# EAGLE schematic PortableLinuxGamestation (EAGLE 9.1.2)
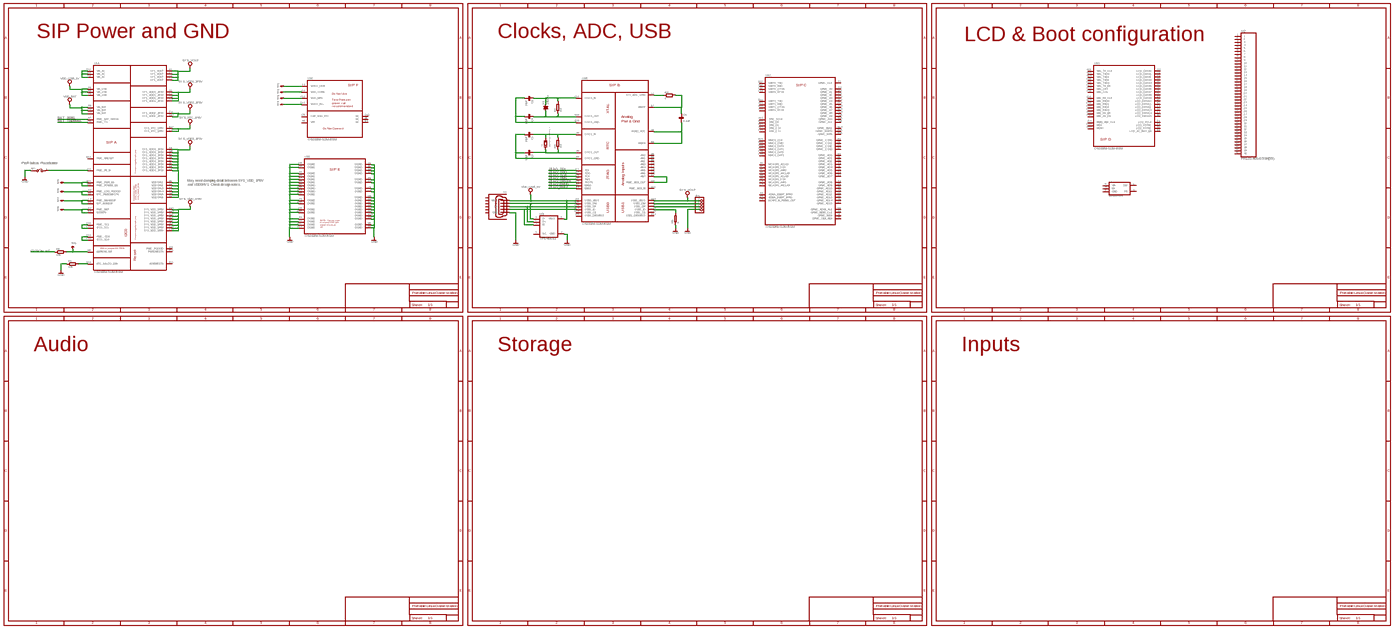
[diagram p0: schematic, sheet 1, overview]
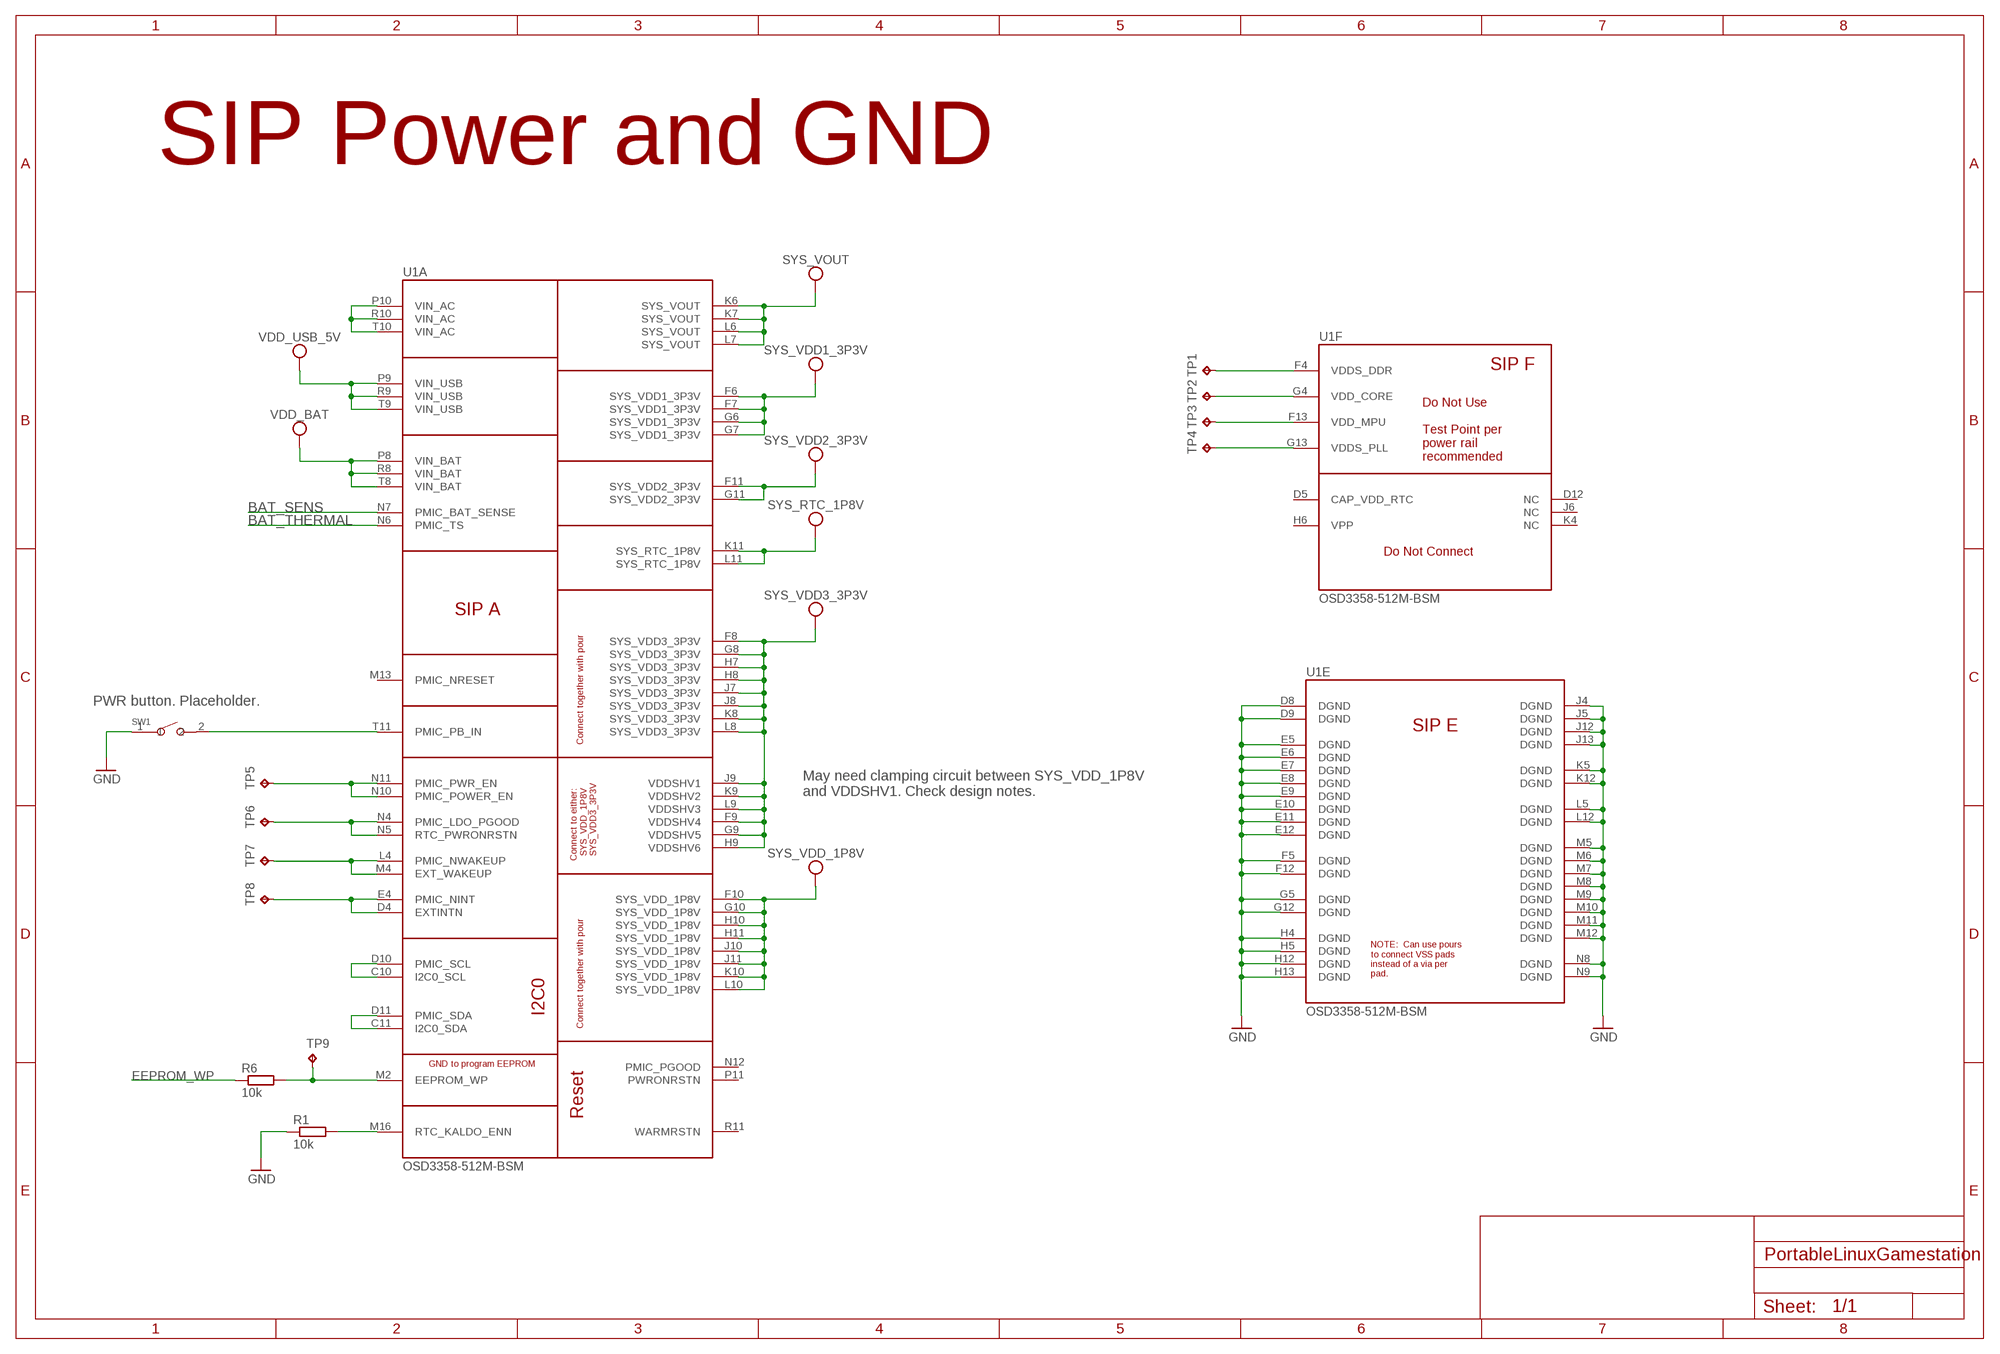
[diagram p1: schematic, sheet 1, part 1 of 8]
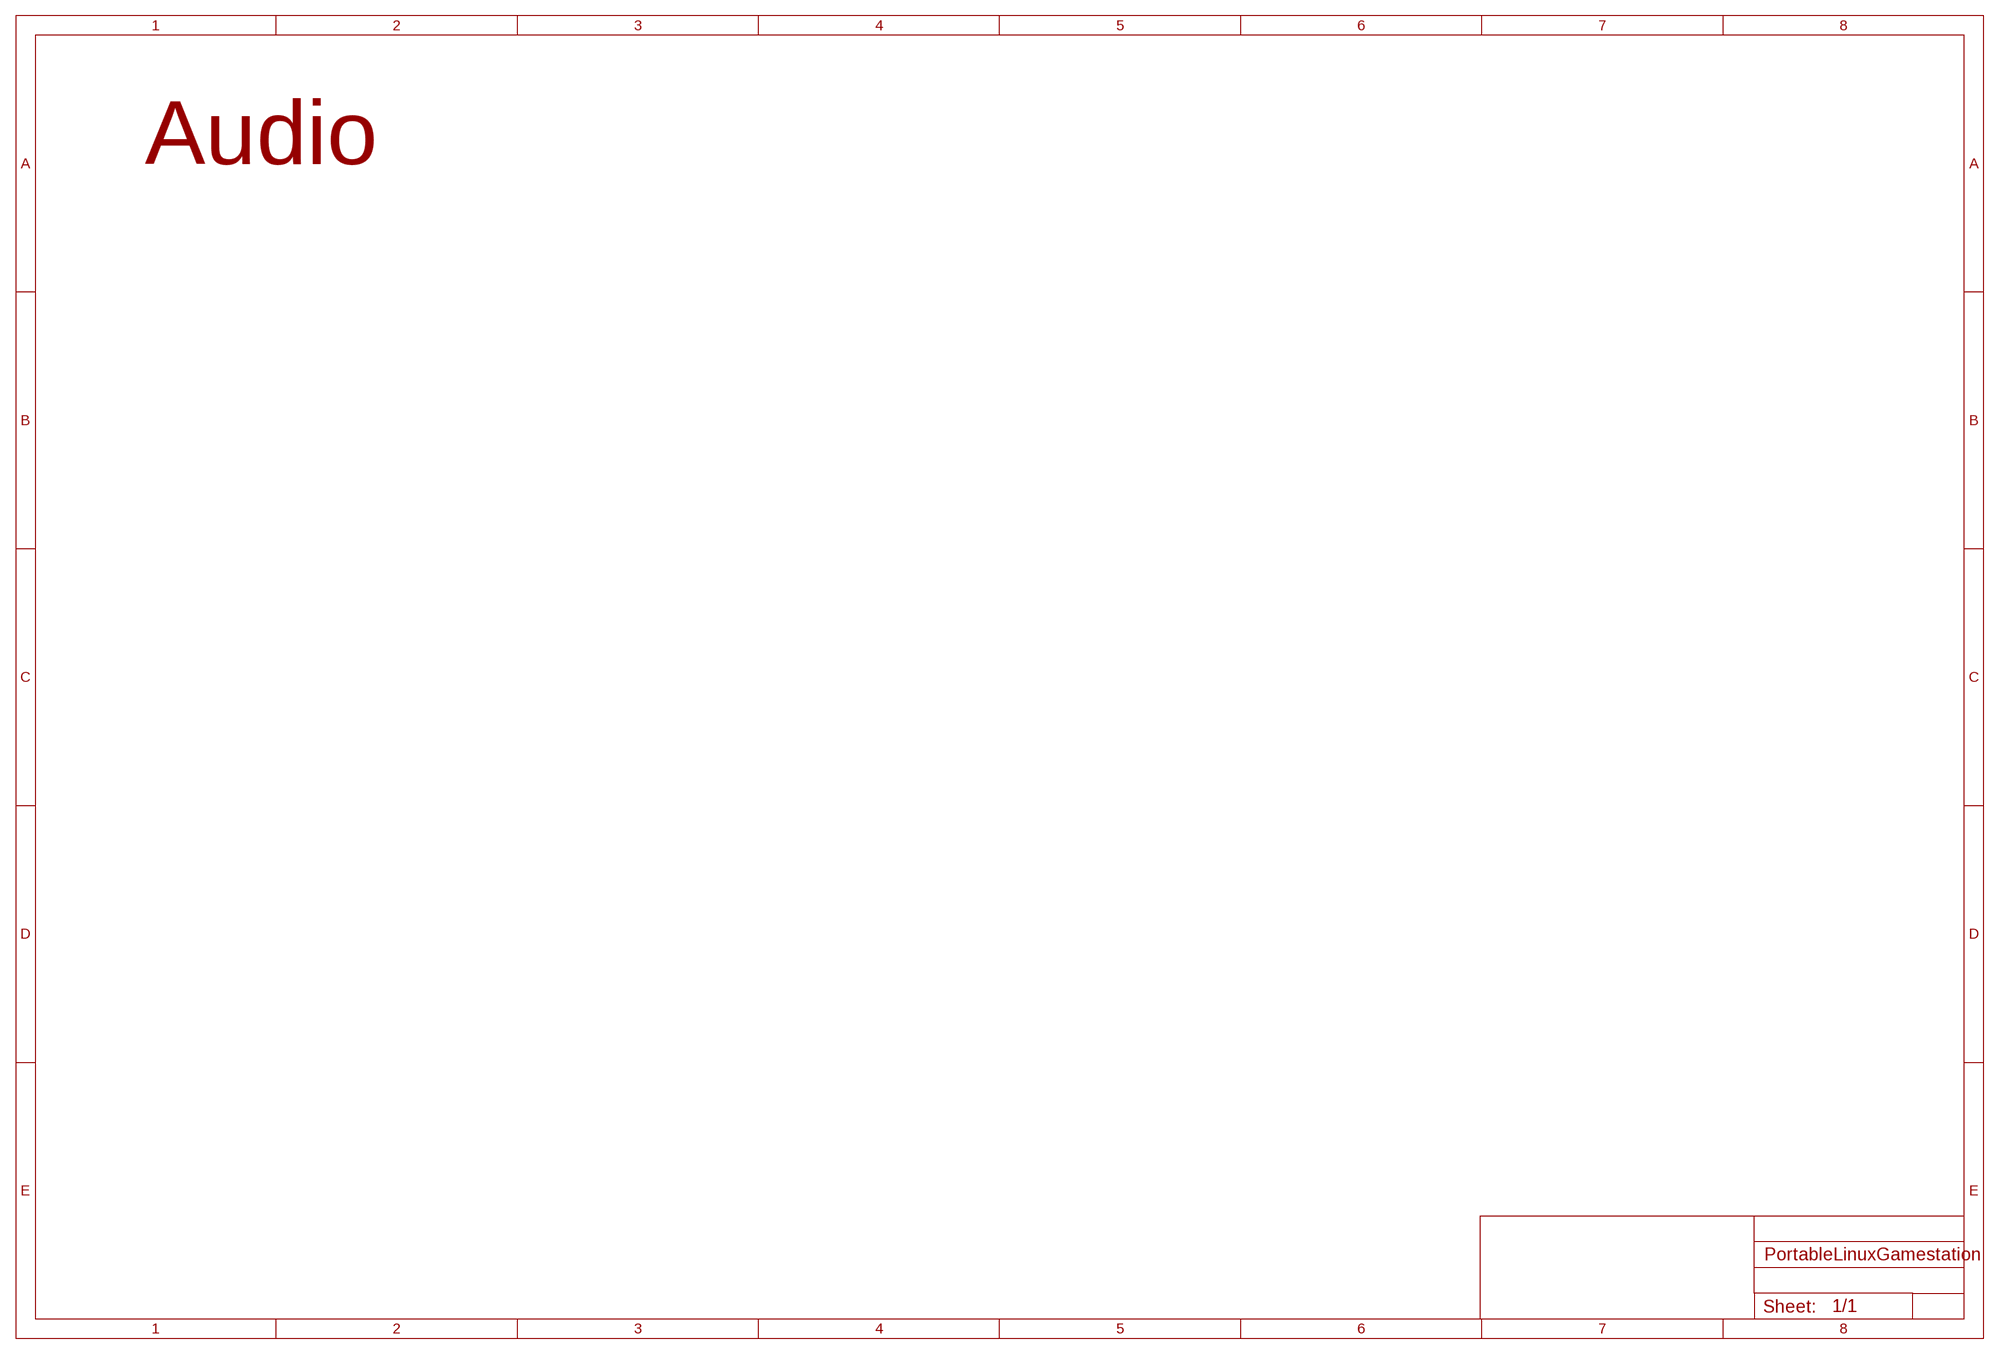
[diagram p2: schematic, sheet 1, part 2 of 8]
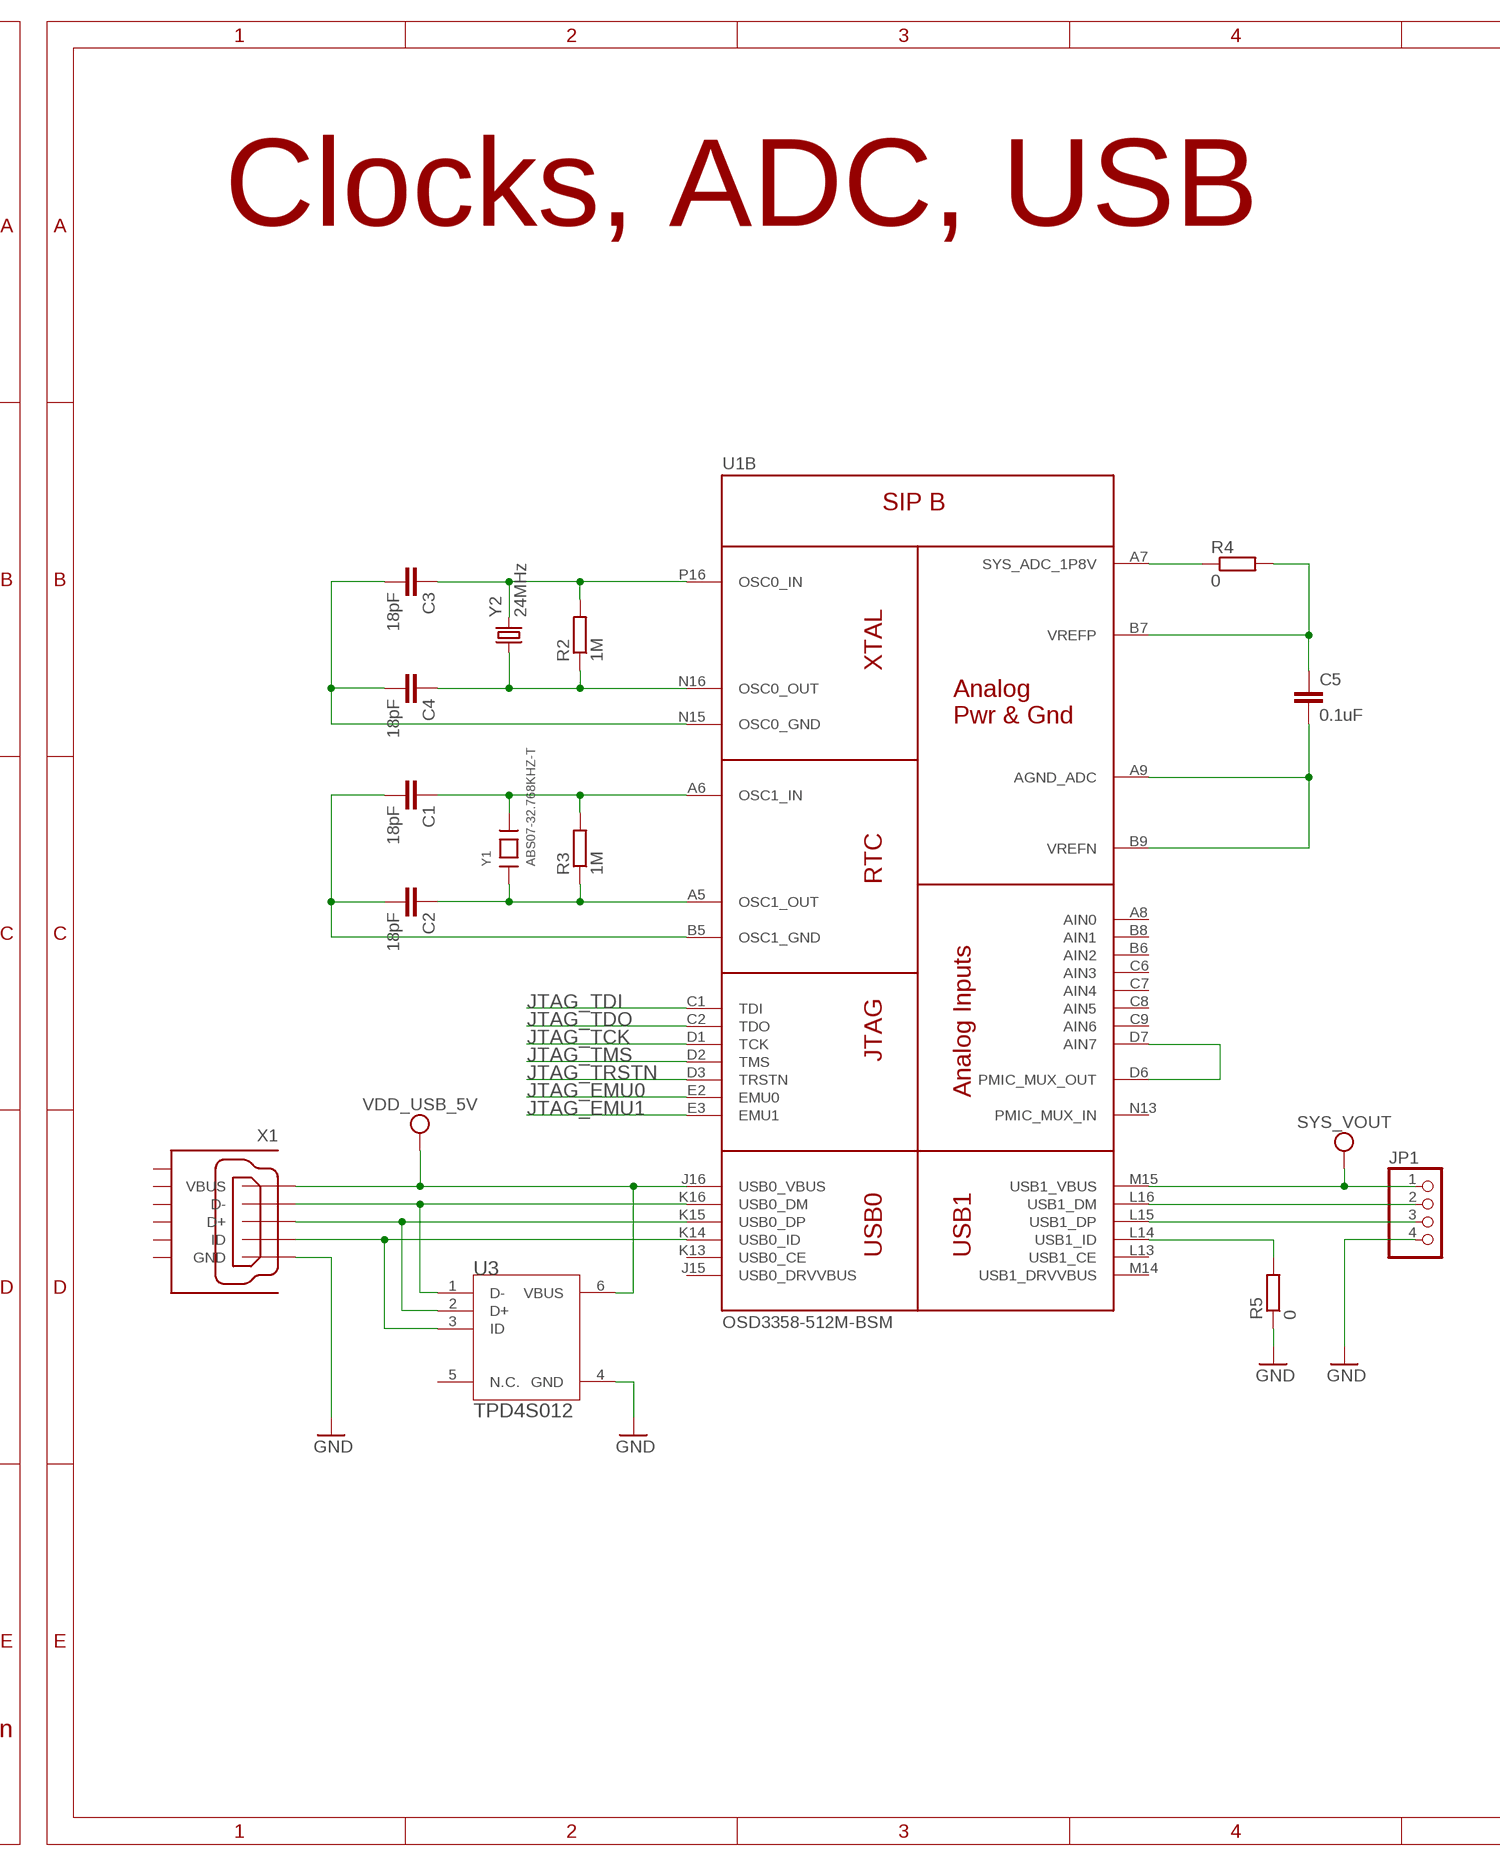
[diagram p3: schematic, sheet 1, part 3 of 8]
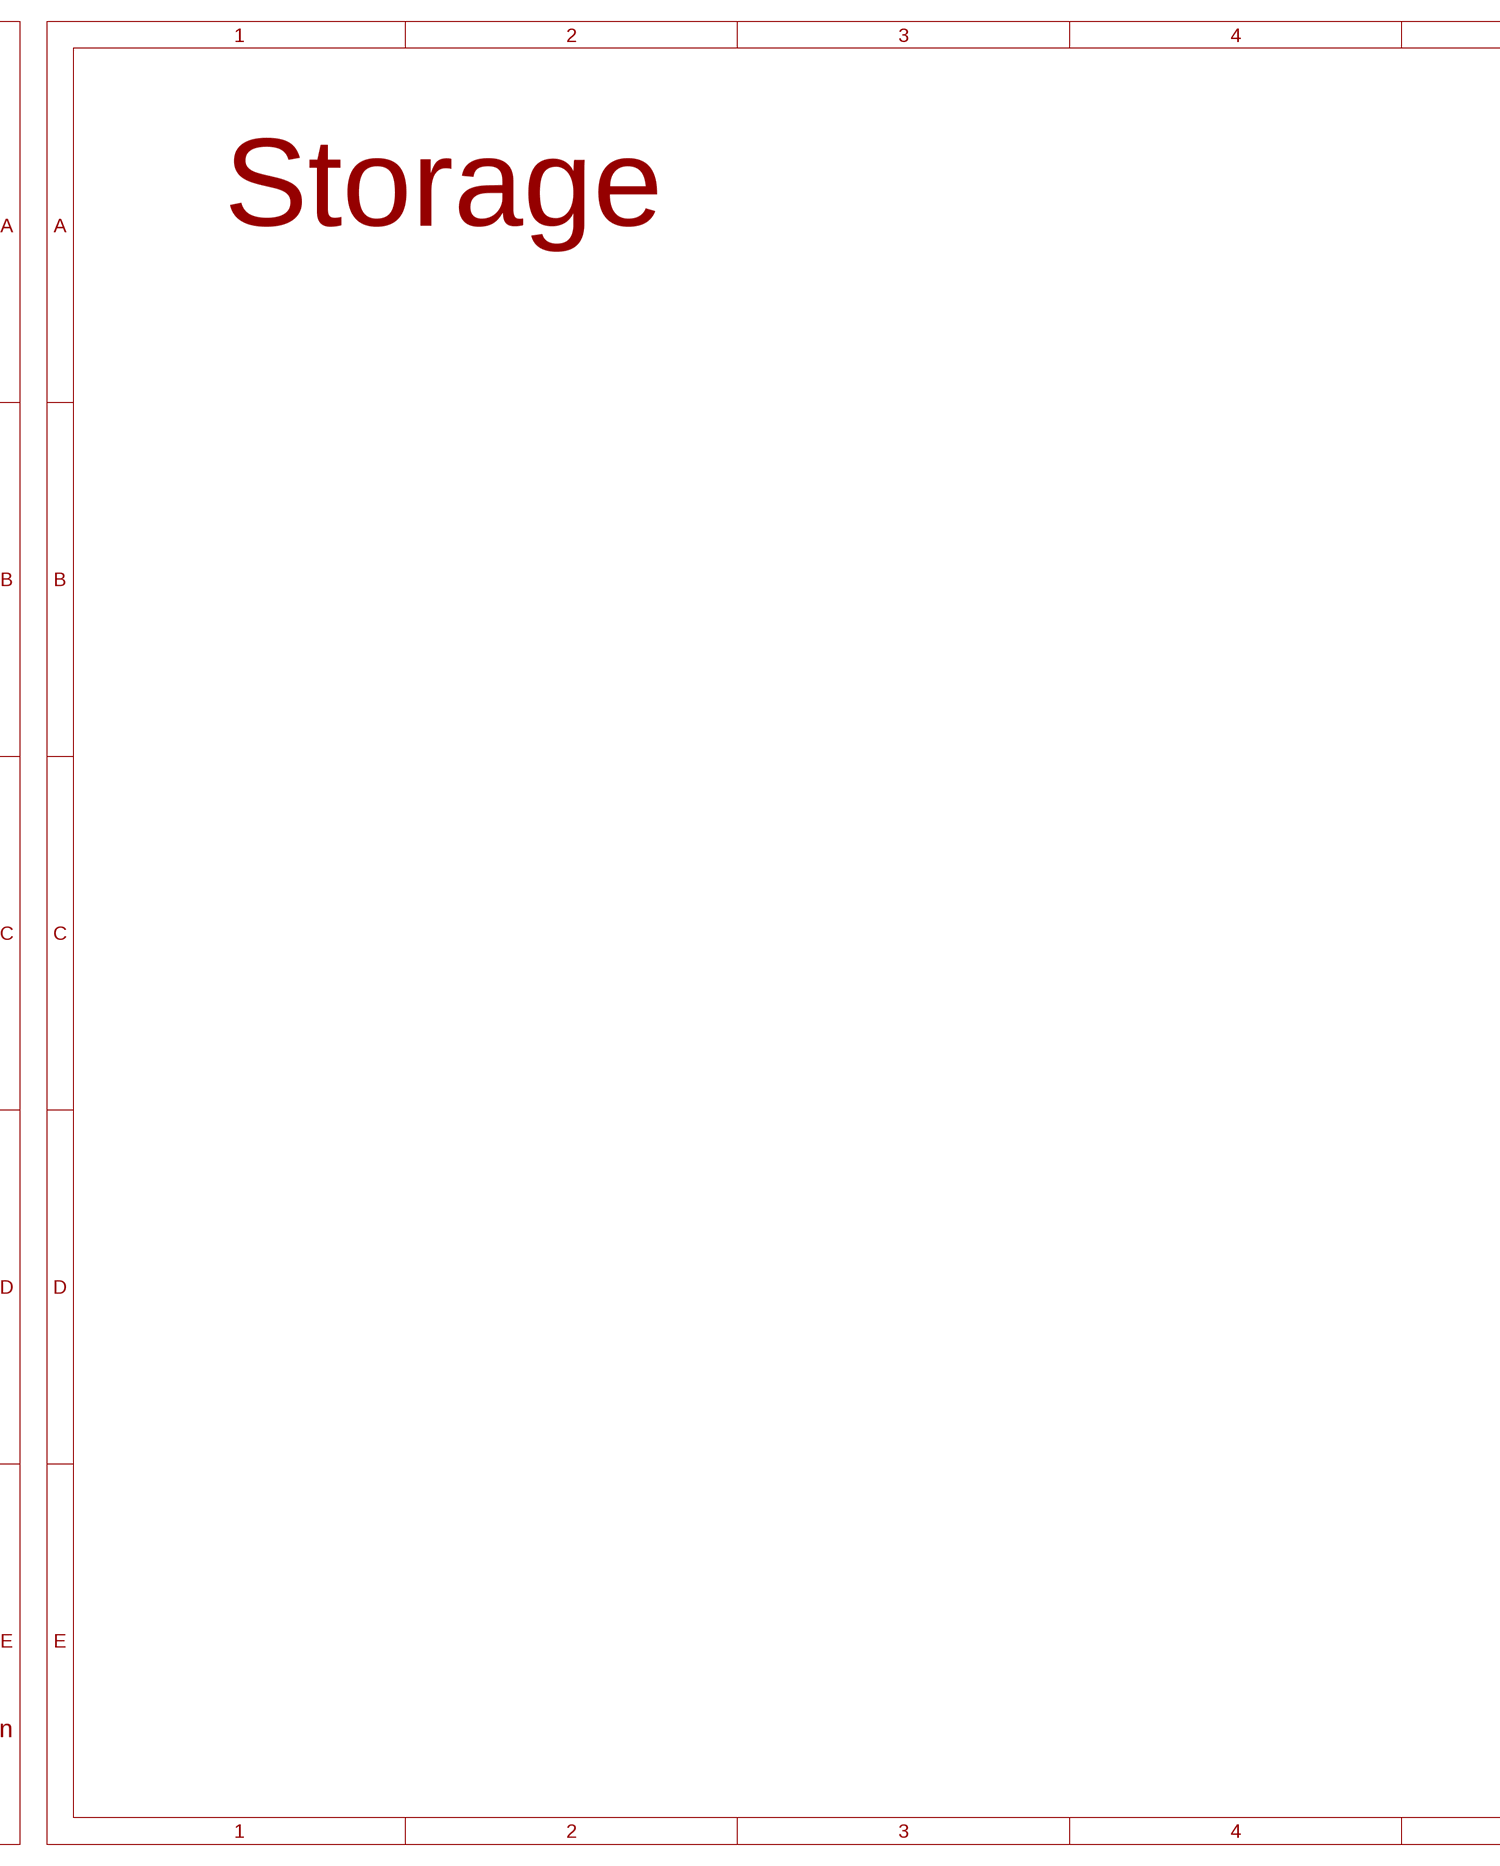
[diagram p4: schematic, sheet 1, part 4 of 8]
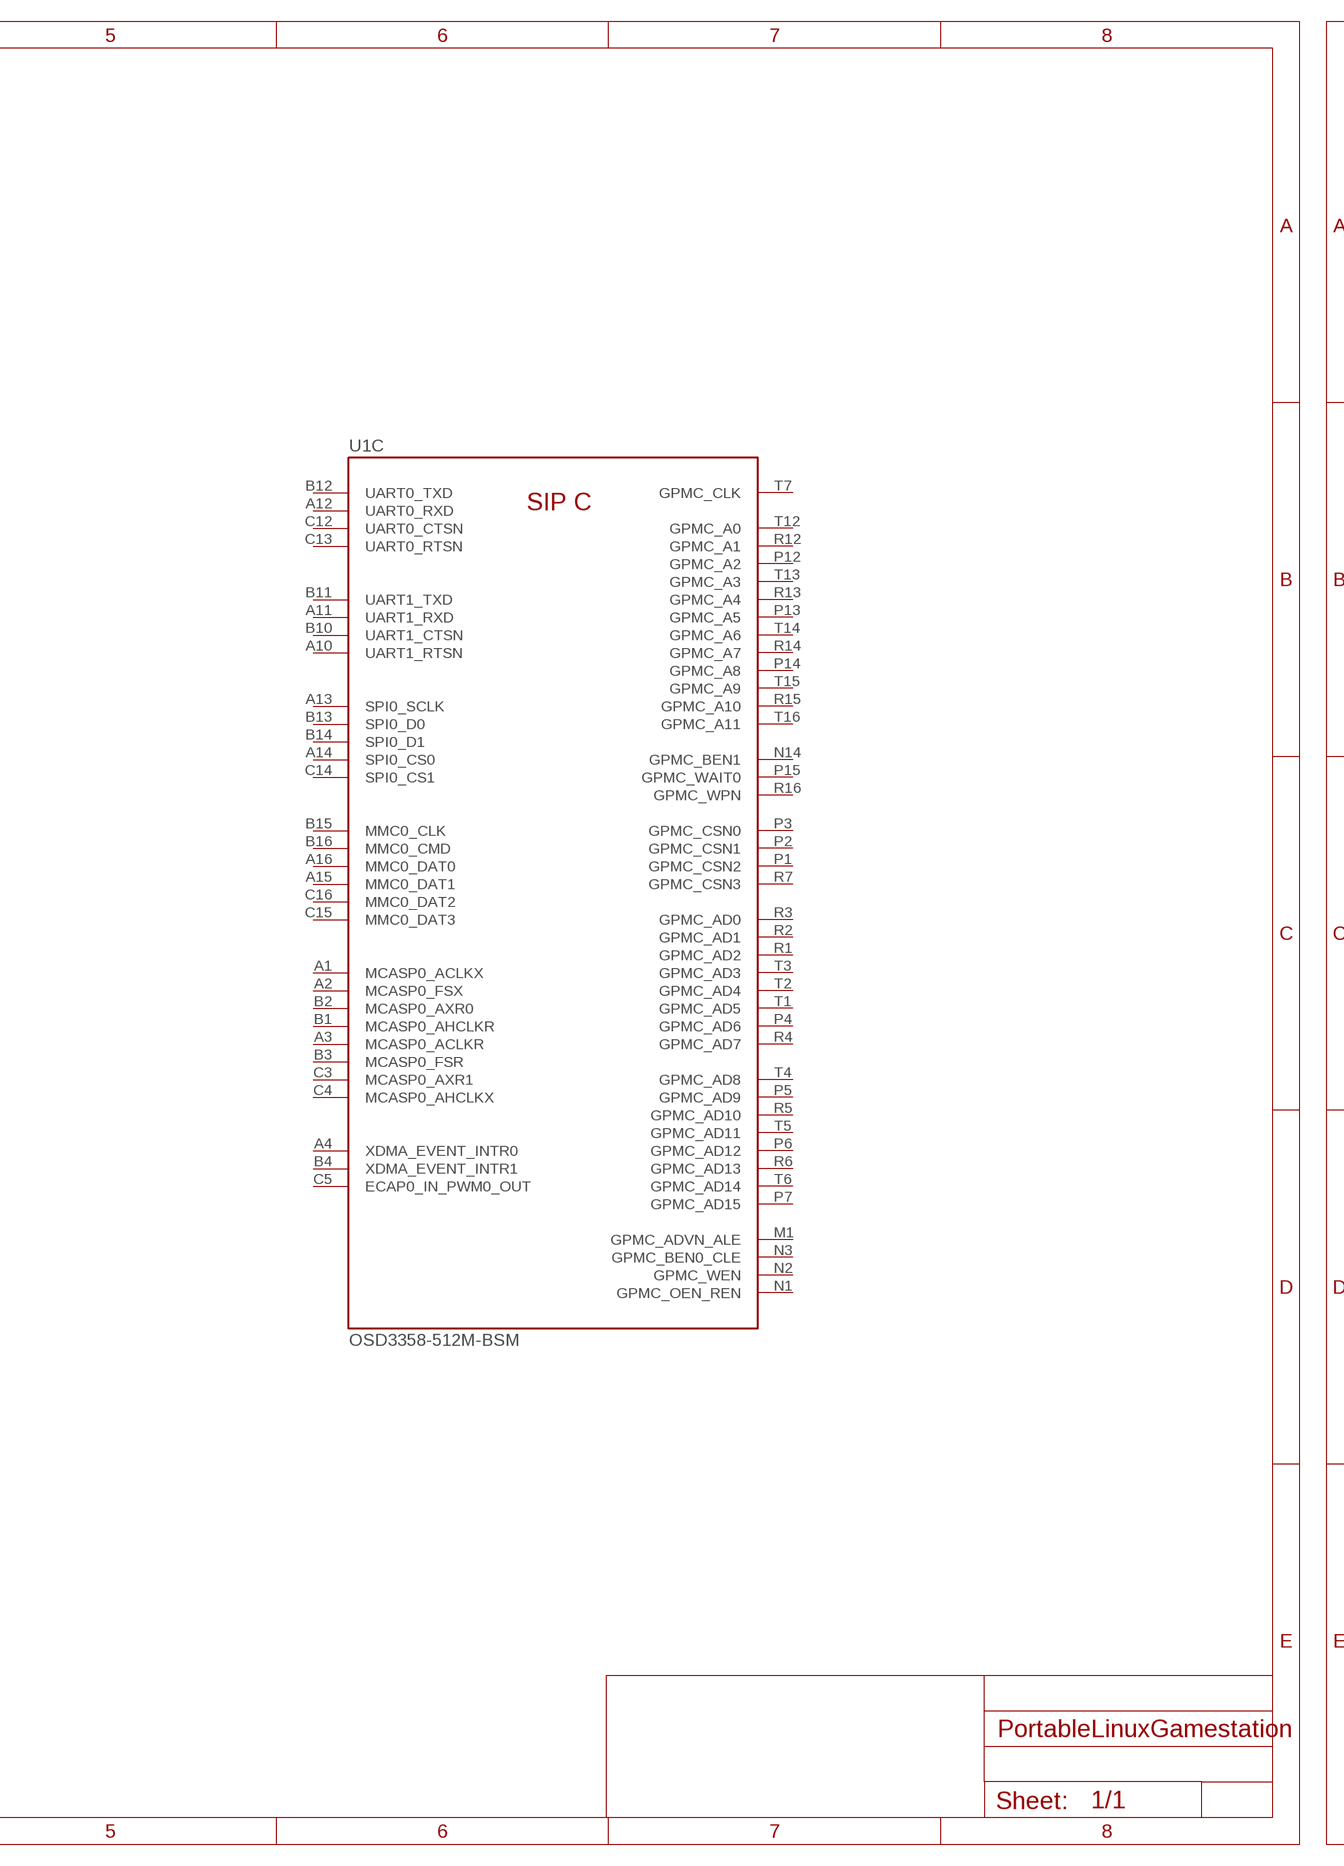
[diagram p5: schematic, sheet 1, part 5 of 8]
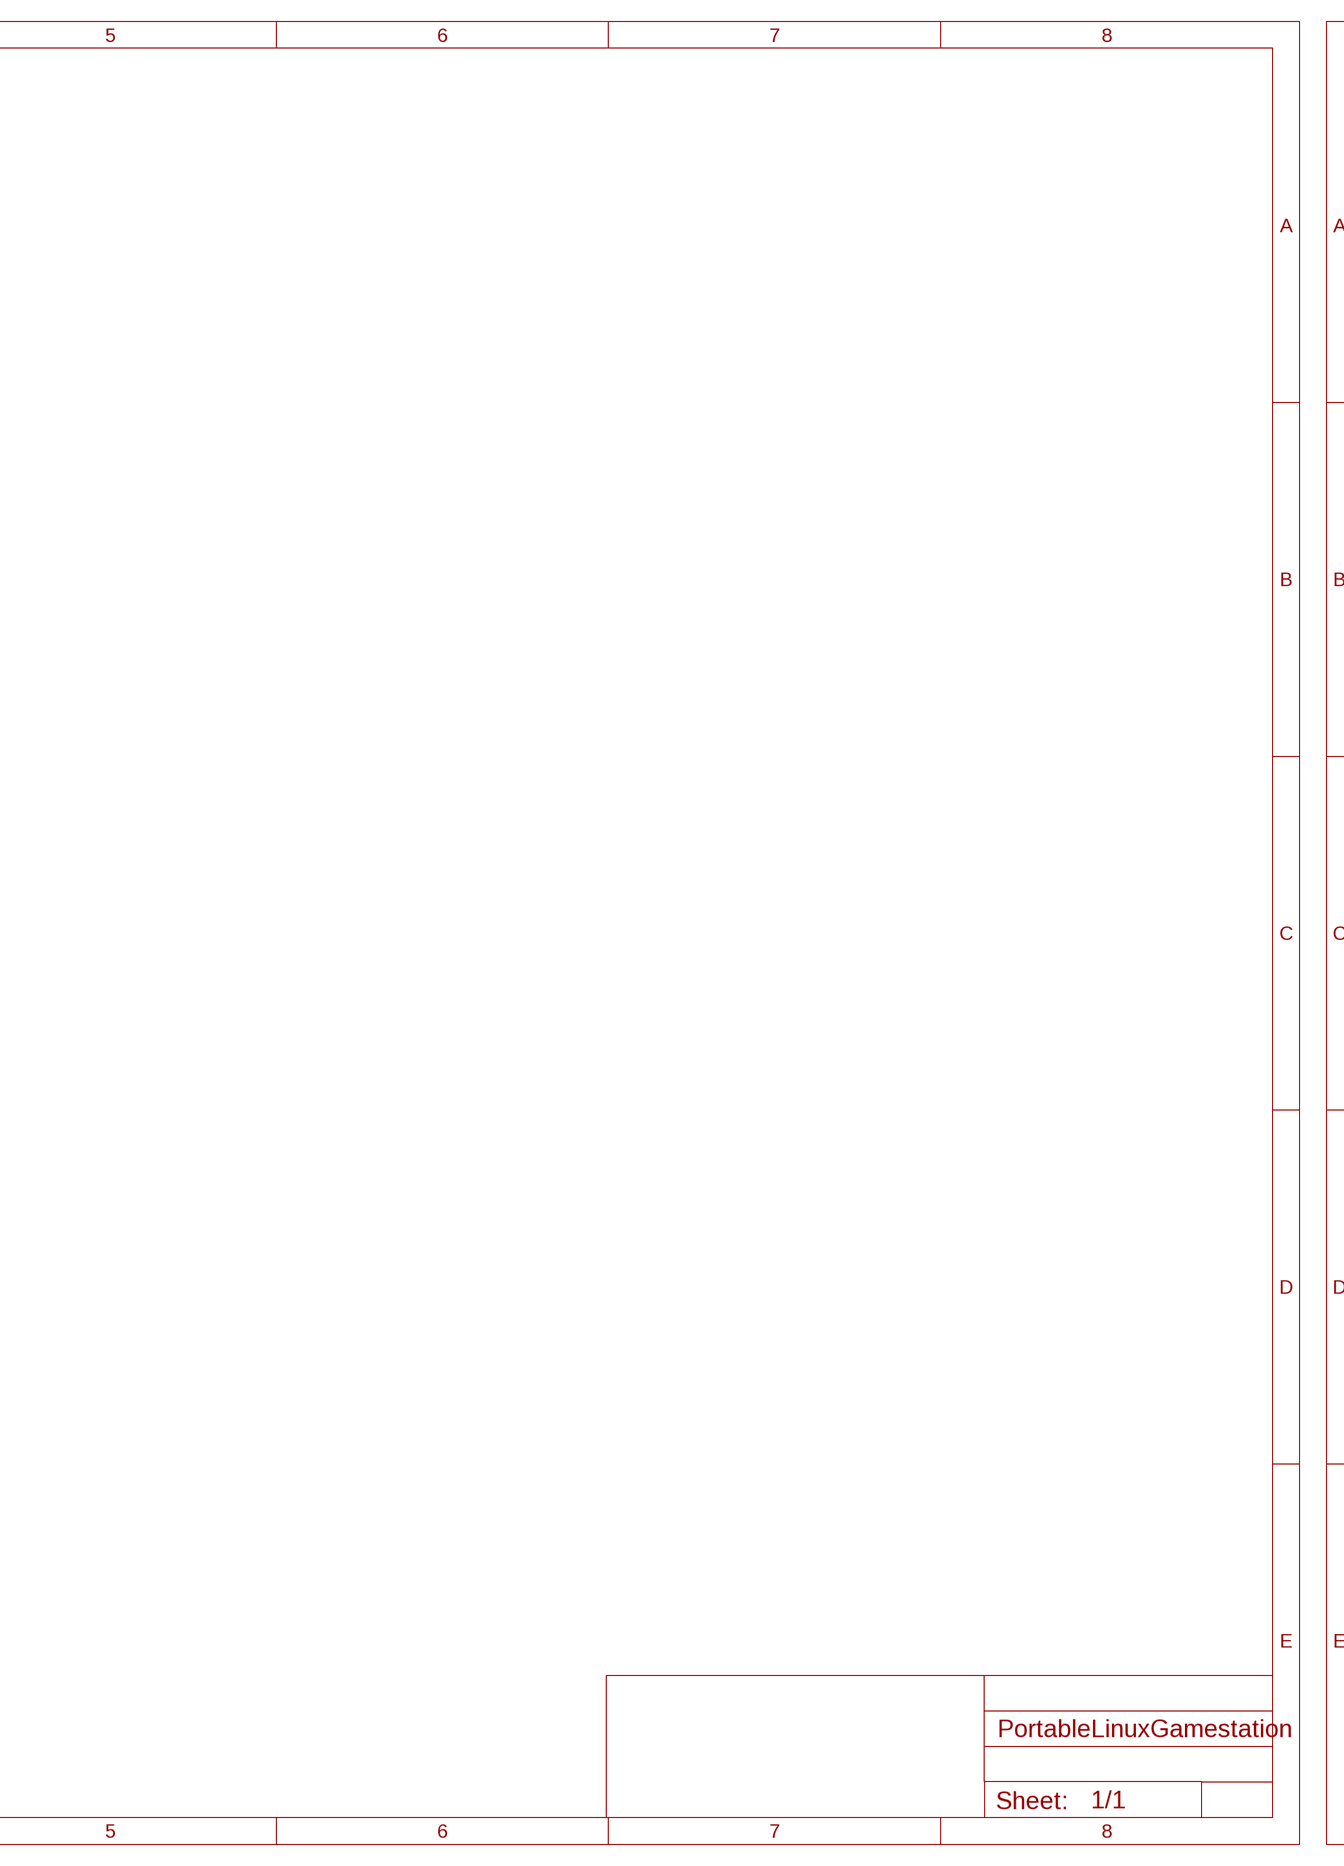
[diagram p6: schematic, sheet 1, part 6 of 8]
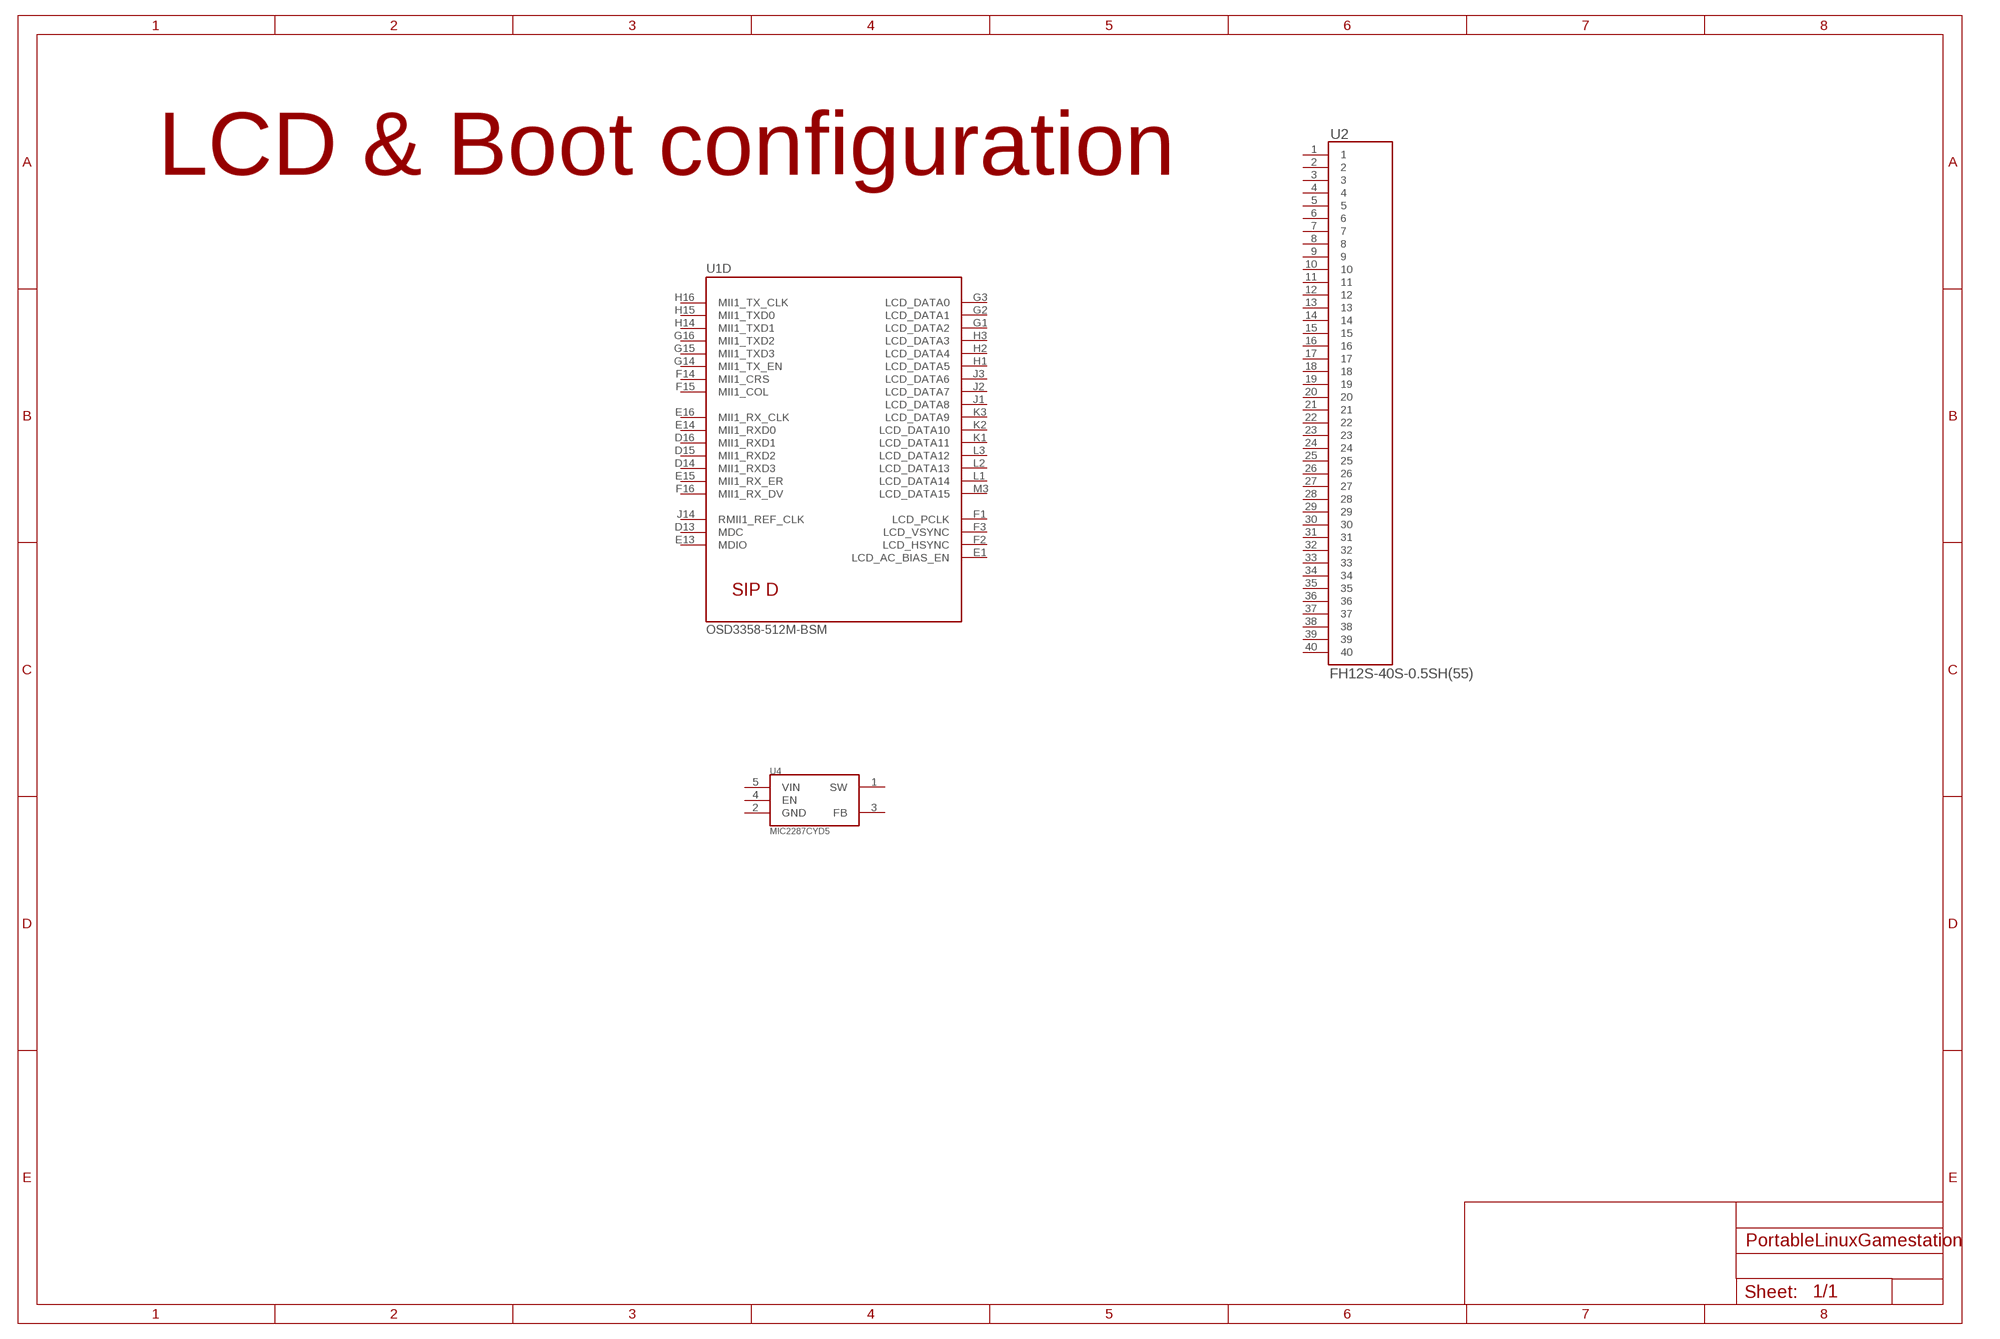
[diagram p7: schematic, sheet 1, part 7 of 8]
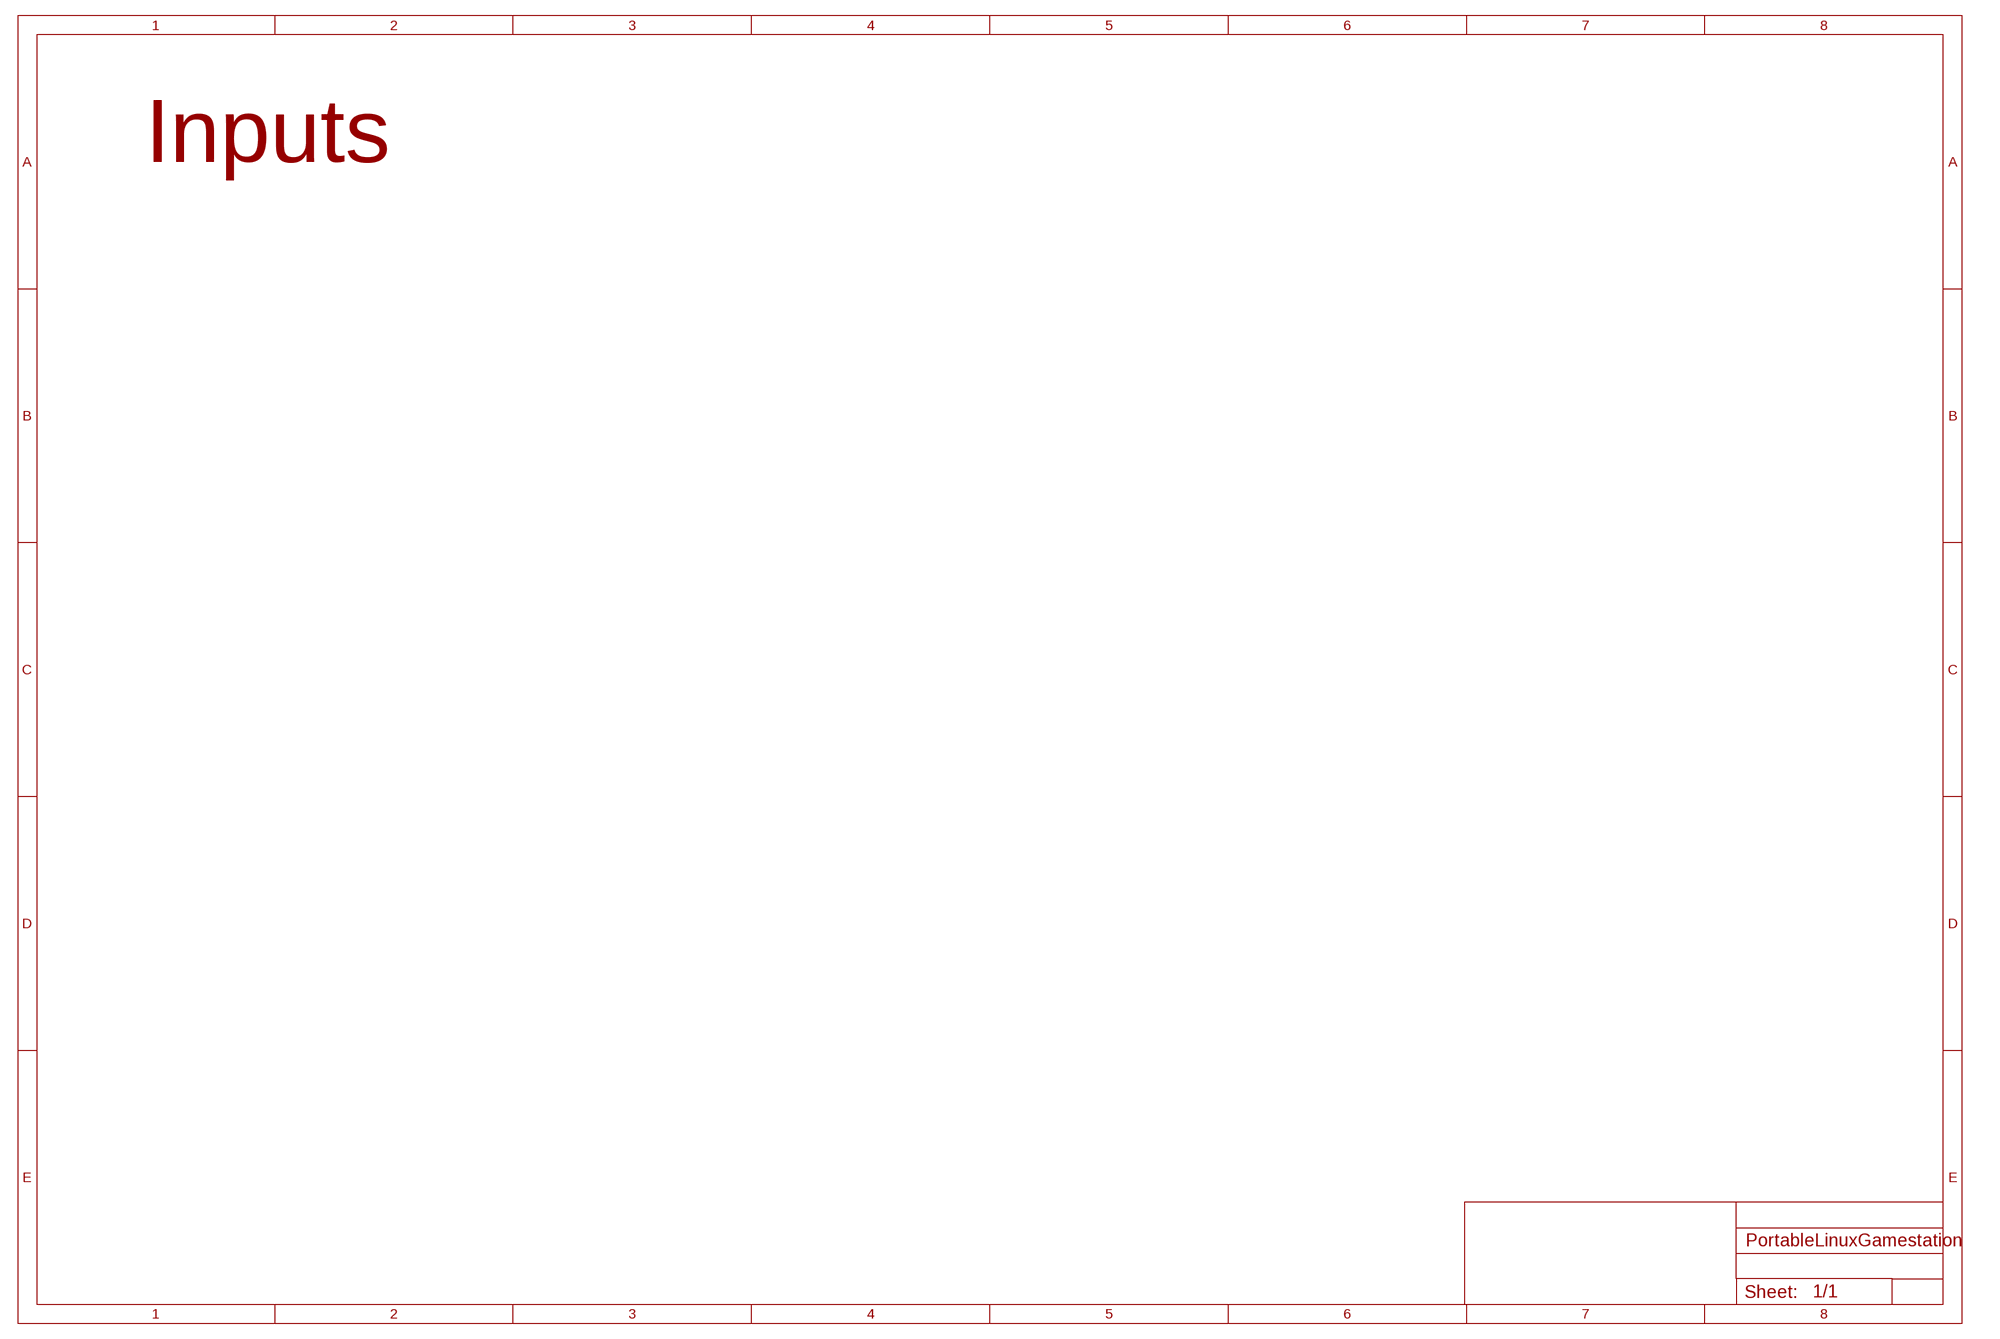
[diagram p8: schematic, sheet 1, part 8 of 8]

## Parts
C1  18pF  CC0603  [C0603]
C2  18pF  CC0603  [C0603]
C3  18pF  CC0603  [C0603]
C4  18pF  CC0603  [C0603]
C5  0.1uF  CC0805  [C0805]
JP1  PINHD-1X4  [1X04]
R1  10k  R-EU_M0805  [M0805]
R2  1M  R-EU_R0603  [R0603]
R3  1M  R-EU_R0603  [R0603]
R4  0  R-EU_R0805  [R0805]
R5  0  R-EU_R0603  [R0603]
R6  10k  R-EU_M0805  [M0805]
SW1  SMD-BUTTON(2P-3.0X2.5X1.2+0.4MM)-B3U-1000P-2P-SMD  [SW2-2.6-3.0X2.5X1.2+0.4MM]
TP1  TPB1,27  [TP_B1,27]
TP2  TPB1,27  [TP_B1,27]
TP3  TPB1,27  [TP_B1,27]
TP4  TPB1,27  [TP_B1,27]
TP5  TPB1,27  [TP_B1,27]
TP6  TPB1,27  [TP_B1,27]
TP7  TPB1,27  [TP_B1,27]
TP8  TPB1,27  [TP_B1,27]
TP9  TPB1,27  [TP_B1,27]
U1  OSD3358-512M-BSM  [OSD335X-BGA-256]
U2  FH12S-40S-0.5SH(55)  [HIROSE_FH12S-40S-0.5SH(55)]
U3  TPD4S012  TPD4S012_DRY_6_P1_M  [DRY6]
U4  MIC2287CYD5  [SOT23-5L]
X1  10118192-0001LF  [10118192-0001LF(MICRO-USB-B-AMPHENOL-FCI)]
Y1  ABS07-32.768KHZ-T  [CRYSTAL_3.2X1.5]
Y2  24MHz  7A-24.000MAAJ-T  [CRYSTAL-TXC-7A]

## Nets
BAT_SENS: U1.N7(A:PMIC_BAT_SENSE)
BAT_THERMAL: U1.N6(A:PMIC_TS)
EEPROM_WP: R6.1
GND: JP1.4 R1.1 R5.1 SW1.1 U1.D8(E:DGND) U1.D9(E:DGND) U1.E5(E:DGND) U1.E6(E:DGND) U1.E7(E:DGND) U1.E8(E:DGND) U1.E9(E:DGND) U1.E10(E:DGND) U1.E11(E:DGND) U1.E12(E:DGND) U1.F5(E:DGND) U1.F12(E:DGND) U1.G5(E:DGND) U1.G12(E:DGND) U1.H4(E:DGND) U1.H5(E:DGND) U1.H12(E:DGND) U1.H13(E:DGND) U1.J4(E:DGND) U1.J5(E:DGND) U1.J12(E:DGND) U1.J13(E:DGND) U1.K5(E:DGND) U1.K12(E:DGND) U1.L5(E:DGND) U1.L12(E:DGND) U1.M5(E:DGND) U1.M6(E:DGND) U1.M7(E:DGND) U1.M8(E:DGND) U1.M9(E:DGND) U1.M10(E:DGND) U1.M11(E:DGND) U1.M12(E:DGND) U1.N8(E:DGND) U1.N9(E:DGND) U3.4(GND) X1.GND
JTAG_EMU0: U1.E2(B:EMU0)
JTAG_EMU1: U1.E3(B:EMU1)
JTAG_TCK: U1.D1(B:TCK)
JTAG_TDI: U1.C1(B:TDI)
JTAG_TDO: U1.C2(B:TDO)
JTAG_TMS: U1.D2(B:TMS)
JTAG_TRSTN: U1.D3(B:TRSTN)
N$1: TP1.TP U1.F4(F:VDDS_DDR)
N$2: TP2.TP U1.G4(F:VDD_CORE)
N$3: TP3.TP U1.F13(F:VDD_MPU)
N$4: TP4.TP U1.G13(F:VDDS_PLL)
N$5: U1.C10(A:I2C0_SCL) U1.D10(A:PMIC_SCL)
N$6: U1.C11(A:I2C0_SDA) U1.D11(A:PMIC_SDA)
N$7: U1.P10(A:VIN_AC) U1.R10(A:VIN_AC) U1.T10(A:VIN_AC)
N$8: TP5.TP U1.N10(A:PMIC_POWER_EN) U1.N11(A:PMIC_PWR_EN)
N$9: TP6.TP U1.N4(A:PMIC_LDO_PGOOD) U1.N5(A:RTC_PWRONRSTN)
N$10: TP7.TP U1.L4(A:PMIC_NWAKEUP) U1.M4(A:EXT_WAKEUP)
N$11: TP8.TP U1.D4(A:EXTINTN) U1.E4(A:PMIC_NINT)
N$12: R1.2 U1.M16(A:RTC_KALDO_ENN)
N$13: SW1.2 U1.T11(A:PMIC_PB_IN)
N$14: C3.1 R2.2 U1.P16(B:OSC0_IN) Y2.P$2
N$15: C4.1 R2.1 U1.N16(B:OSC0_OUT) Y2.P$1
N$16: C1.1 R3.2 U1.A6(B:OSC1_IN) Y1.P$2
N$17: C2.1 R3.1 U1.A5(B:OSC1_OUT) Y1.P$1
N$18: R4.1 U1.A7(B:SYS_ADC_1P8V)
N$19: C5.1 R4.2 U1.B7(B:VREFP)
N$20: C5.2 U1.A9(B:AGND_ADC) U1.B9(B:VREFN)
N$21: U1.D6(B:PMIC_MUX_OUT) U1.D7(B:AIN7)
N$22: C3.2 C4.2 U1.N15(B:OSC0_GND)
N$23: C1.2 C2.2 U1.B5(B:OSC1_GND)
N$24: R5.2 U1.L14(B:USB1_ID)
N$25: U1.K16(B:USB0_DM) U3.1(D-) X1.D-
N$26: U1.K15(B:USB0_DP) U3.2(D+) X1.D+
N$27: U1.K14(B:USB0_ID) U3.3(ID) X1.ID
N$28: R6.2 TP9.TP U1.M2(A:EEPROM_WP)
N$29: JP1.2 U1.L16(B:USB1_DM)
N$30: JP1.3 U1.L15(B:USB1_DP)
SYS_RTC_1P8V: U1.K11(A:SYS_RTC_1P8V) U1.L11(A:SYS_RTC_1P8V)
SYS_VDD1_3P3V: U1.F6(A:SYS_VDD1_3P3V) U1.F7(A:SYS_VDD1_3P3V) U1.G6(A:SYS_VDD1_3P3V) U1.G7(A:SYS_VDD1_3P3V)
SYS_VDD2_3P3V: U1.F11(A:SYS_VDD2_3P3V) U1.G11(A:SYS_VDD2_3P3V)
SYS_VDD3_3P3V: U1.F8(A:SYS_VDD3_3P3V) U1.F9(A:VDDSHV4) U1.G8(A:SYS_VDD3_3P3V) U1.G9(A:VDDSHV5) U1.H7(A:SYS_VDD3_3P3V) U1.H8(A:SYS_VDD3_3P3V) U1.H9(A:VDDSHV6) U1.J7(A:SYS_VDD3_3P3V) U1.J8(A:SYS_VDD3_3P3V) U1.J9(A:VDDSHV1) U1.K8(A:SYS_VDD3_3P3V) U1.K9(A:VDDSHV2) U1.L8(A:SYS_VDD3_3P3V) U1.L9(A:VDDSHV3)
SYS_VDD_1P8V: U1.F10(A:SYS_VDD_1P8V) U1.G10(A:SYS_VDD_1P8V) U1.H10(A:SYS_VDD_1P8V) U1.H11(A:SYS_VDD_1P8V) U1.J10(A:SYS_VDD_1P8V) U1.J11(A:SYS_VDD_1P8V) U1.K10(A:SYS_VDD_1P8V) U1.L10(A:SYS_VDD_1P8V)
SYS_VOUT: JP1.1 U1.K6(A:SYS_VOUT) U1.K7(A:SYS_VOUT) U1.L6(A:SYS_VOUT) U1.L7(A:SYS_VOUT) U1.M15(B:USB1_VBUS)
VDD_BAT: U1.P8(A:VIN_BAT) U1.R8(A:VIN_BAT) U1.T8(A:VIN_BAT)
VDD_USB_5V: U1.J16(B:USB0_VBUS) U1.P9(A:VIN_USB) U1.R9(A:VIN_USB) U1.T9(A:VIN_USB) U3.6(VBUS) X1.VBUS
Unconnected: U1.A1(C:MCASP0_ACLKX) U1.A2(C:MCASP0_FSX) U1.A3(C:MCASP0_ACLKR) U1.A4(C:XDMA_EVENT_INTR0) U1.A8(B:AIN0) U1.A10(C:UART1_RTSN) U1.A11(C:UART1_RXD) U1.A12(C:UART0_RXD) U1.A13(C:SPI0_SCLK) U1.A14(C:SPI0_CS0) U1.A15(C:MMC0_DAT1) U1.A16(C:MMC0_DAT0) U1.B1(C:MCASP0_AHCLKR) U1.B2(C:MCASP0_AXR0) U1.B3(C:MCASP0_FSR) U1.B4(C:XDMA_EVENT_INTR1) U1.B6(B:AIN2) U1.B8(B:AIN1) U1.B10(C:UART1_CTSN) U1.B11(C:UART1_TXD) U1.B12(C:UART0_TXD) U1.B13(C:SPI0_D0) U1.B14(C:SPI0_D1) U1.B15(C:MMC0_CLK) U1.B16(C:MMC0_CMD) U1.C3(C:MCASP0_AXR1) U1.C4(C:MCASP0_AHCLKX) U1.C5(C:ECAP0_IN_PWM0_OUT) U1.C6(B:AIN3) U1.C7(B:AIN4) U1.C8(B:AIN5) U1.C9(B:AIN6) U1.C12(C:UART0_CTSN) U1.C13(C:UART0_RTSN) U1.C14(C:SPI0_CS1) U1.C15(C:MMC0_DAT3) U1.C16(C:MMC0_DAT2) U1.D5(F:CAP_VDD_RTC) U1.D12(F:NC) U1.D13(D:MDC) U1.D14(D:MII1_RXD3) U1.D15(D:MII1_RXD2) U1.D16(D:MII1_RXD1) U1.E1(D:LCD_AC_BIAS_EN) U1.E13(D:MDIO) U1.E14(D:MII1_RXD0) U1.E15(D:MII1_RX_ER) U1.E16(D:MII1_RX_CLK) U1.F1(D:LCD_PCLK) U1.F2(D:LCD_HSYNC) U1.F3(D:LCD_VSYNC) U1.F14(D:MII1_CRS) U1.F15(D:MII1_COL) U1.F16(D:MII1_RX_DV) U1.G1(D:LCD_DATA2) U1.G2(D:LCD_DATA1) U1.G3(D:LCD_DATA0) U1.G14(D:MII1_TX_EN) U1.G15(D:MII1_TXD3) U1.G16(D:MII1_TXD2) U1.H1(D:LCD_DATA5) U1.H2(D:LCD_DATA4) U1.H3(D:LCD_DATA3) U1.H6(F:VPP) U1.H14(D:MII1_TXD1) U1.H15(D:MII1_TXD0) U1.H16(D:MII1_TX_CLK) U1.J1(D:LCD_DATA8) U1.J2(D:LCD_DATA7) U1.J3(D:LCD_DATA6) U1.J6(F:NC) U1.J14(D:RMII1_REF_CLK) U1.J15(B:USB0_DRVVBUS) U1.K1(D:LCD_DATA11) U1.K2(D:LCD_DATA10) U1.K3(D:LCD_DATA9) U1.K4(F:NC) U1.K13(B:USB0_CE) U1.L1(D:LCD_DATA14) U1.L2(D:LCD_DATA13) U1.L3(D:LCD_DATA12) U1.L13(B:USB1_CE) U1.M1(C:GPMC_ADVN_ALE) U1.M3(D:LCD_DATA15) U1.M13(A:PMIC_NRESET) U1.M14(B:USB1_DRVVBUS) U1.N1(C:GPMC_OEN_REN) U1.N2(C:GPMC_WEN) U1.N3(C:GPMC_BEN0_CLE) U1.N12(A:PMIC_PGOOD) U1.N13(B:PMIC_MUX_IN) U1.N14(C:GPMC_BEN1) U1.P1(C:GPMC_CSN2) U1.P2(C:GPMC_CSN1) U1.P3(C:GPMC_CSN0) U1.P4(C:GPMC_AD6) U1.P5(C:GPMC_AD9) U1.P6(C:GPMC_AD12) U1.P7(C:GPMC_AD15) U1.P11(A:PWRONRSTN) U1.P12(C:GPMC_A2) U1.P13(C:GPMC_A5) U1.P14(C:GPMC_A8) U1.P15(C:GPMC_WAIT0) U1.R1(C:GPMC_AD2) U1.R2(C:GPMC_AD1) U1.R3(C:GPMC_AD0) U1.R4(C:GPMC_AD7) U1.R5(C:GPMC_AD10) U1.R6(C:GPMC_AD13) U1.R7(C:GPMC_CSN3) U1.R11(A:WARMRSTN) U1.R12(C:GPMC_A1) U1.R13(C:GPMC_A4) U1.R14(C:GPMC_A7) U1.R15(C:GPMC_A10) U1.R16(C:GPMC_WPN) U1.T1(C:GPMC_AD5) U1.T2(C:GPMC_AD4) U1.T3(C:GPMC_AD3) U1.T4(C:GPMC_AD8) U1.T5(C:GPMC_AD11) U1.T6(C:GPMC_AD14) U1.T7(C:GPMC_CLK) U1.T12(C:GPMC_A0) U1.T13(C:GPMC_A3) U1.T14(C:GPMC_A6) U1.T15(C:GPMC_A9) U1.T16(C:GPMC_A11) U2.1 U2.2 U2.3 U2.4 U2.5 U2.6 U2.7 U2.8 U2.9 U2.10 U2.11 U2.12 U2.13 U2.14 U2.15 U2.16 U2.17 U2.18 U2.19 U2.20 U2.21 U2.22 U2.23 U2.24 U2.25 U2.26 U2.27 U2.28 U2.29 U2.30 U2.31 U2.32 U2.33 U2.34 U2.35 U2.36 U2.37 U2.38 U2.39 U2.40 U3.5(N.C.) U4.1(SW) U4.3(FB) U4.4(EN) X1.CGND1(SGND1) X1.CGND2(SGND2) X1.CGND3(SGND3) X1.CGND4(SGND4) X1.CGND5(SGND5) X1.CGND6(SGND6)

## Notes on the sheet
- SIP Power and GND | Clocks, ADC, USB | LCD & Boot configuration
- PWR button. Placeholder.
- May need clamping circuit between SYS_VDD_1P8V
  and VDDSHV1. Check design notes.
- Audio | Storage | Inputs

## Power pins joined to a net without a drawn wire
GND: U4.2(GND)
VIN: U4.5(VIN)

## Library data of the parts
C1-C5 = PortableLinuxGamestation:C: Capacitor SMD. Sizes: 0402, 0603 & 0805
JP1 = PortableLinuxGamestation:PINHD-1X4: PIN HEADER
R1-R6 = PortableLinuxGamestation:R-EU_: RESISTOR, European symbol
SW1 = PortableLinuxGamestation:SMD-BUTTON(2P-3.0X2.5X1.2+0.4MM): 311020047; MPN: B3U-1000P-2P-SMD; VALUE: B3U-1000P-2P-SMD
TP1-TP9 = PortableLinuxGamestation:TP: Test pad
U1 = PortableLinuxGamestation:OSD3358-512M-BSM: Octavo Systems LLC OSD335x Family SiP: 21mm x 21mm, 1.27mm pitch 256 pin BGA contains AM3358, 512MB DDR3, TPS65217, TL5209, EEPROM and passives. Commerical Temperature: 0C to 85C.
U2 = PortableLinuxGamestation:FH12S-40S-0.5SH(55): SOCKET FFC/FPC, ZIF, 0.5MM, 40WAY; MPN: FH12S-40S-0.5SH(55); OC_FARNELL: 1324588; OC_NEWARK: 34M6197; PACKAGE: SOCKET FFC/FPC, ZIF, 0.5MM, 40WAY; SUPPLIER: Hirose
U3 = PortableLinuxGamestation:TPD4S012_DRY_6; DATASHEETURL: http://www.ti.com/lit/gpn/TPD4S012; FAMILY_NAME: ESD Solution; GENERIC_PART_NUMBER: TPD4S012; INDUSTRY_STD_PKG_TYPE: SON; MANUFACTURER: Texas Instruments; MANUFACTURER_PART_NUMBER: tpd4s012_dry_6; PACKAGE_DESIGNATOR: DRY; PIN_COUNT: 6; VENDOR: Texas Instruments
U4 = PortableLinuxGamestation:MIC2287CYD5
X1 = PortableLinuxGamestation:10118192-0001LF: Amphenol FCI Micro USB Type B Complete Surface Mount (SMT) no guide holes
Y1 = PortableLinuxGamestation:ABS07-32.768KHZ-T: 32kHz crystal
Y2 = PortableLinuxGamestation:7A-24.000MAAJ-T